# Altium schematic sheet PIC16F87.SchDoc
size A4
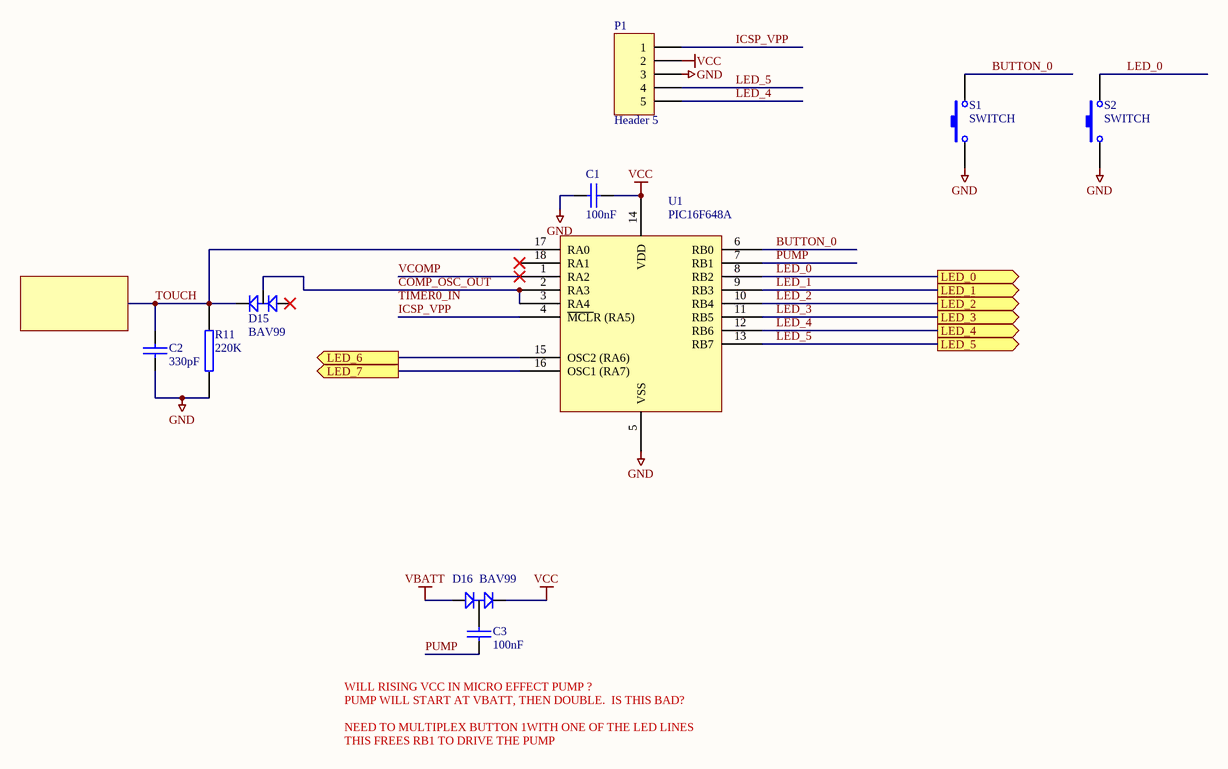
[diagram p0: PIC16F87.SchDoc]

## Parts
C1  100nF  [CAP (3D) - 0603]
C2  330pF  [CAP (3D) - 0603]
C3  100nF  [CAP (3D) - 0603]
D15  BAV99  [SOT23-3L]
D16  BAV99  [SOT23-3L]
P1  Header 5  [HDR1X5]
R11  220K  [RES (3D) - 0603]
S1  SWITCH  [TACT 6mm]
S2  SWITCH  [TACT 6mm]
U1  PIC16F648A  [SOIC-18]

## Ports
LED_0 (out), LED_1 (out), LED_2 (out), LED_3 (out), LED_4 (out), LED_5 (out), LED_6 (out), LED_7 (out)

## Nets
GND: C1.1 C2.2 P1.3 R11.1 S1.1 S2.1 U1.5(VSS)
VBATT: D16.1(A1)
VCC: C1.2 D16.2(C2) P1.2 U1.14(VDD)
BUTTON_0: S1.2 U1.6(RB0)
COMP_OSC_OUT: D15.3(C1/A2) U1.2(RA3) U1.3(RA4)
ICSP_VPP: P1.1 U1.4(~{MCL}R_(RA5))
LED_0: S2.2 U1.8(RB2) ; port LED_0
LED_1: U1.9(RB3) ; port LED_1
LED_2: U1.10(RB4) ; port LED_2
LED_3: U1.11(RB5) ; port LED_3
LED_4: P1.5 U1.12(RB6) ; port LED_4
LED_5: P1.4 U1.13(RB7) ; port LED_5
LED_6: U1.15(OSC2_(RA6)) ; port LED_6
LED_7: U1.16(OSC1_(RA7)) ; port LED_7
PUMP: C3.2 U1.7(RB1)
TOUCH: C2.1 D15.2(C2) R11.2 U1.17(RA0)
VCOMP: U1.1(RA2)
NetC3_1: C3.1 D16.3(C1/A2)

Not connected (* = marked no-connect by the designer): D15 1(A1)*; U1 18(RA1)*

## Notes on the sheet
- (near C3) WILL RISING VCC IN MICRO EFFECT PUMP ?
- PUMP WILL START AT VBATT, THEN DOUBLE.  IS THIS BAD?
- NEED TO MULTIPLEX BUTTON 1WITH ONE OF THE LED LINES
- THIS FREES RB1 TO DRIVE THE PUMP
- Labels drawn without touching a wire or pin: TIMER0_IN

## Library data of the parts
C1-C3 = CAP: CAPACITOR SMD 0402; Supplier 1: Mouser; Supplier Part Number 1: 810-CGJ3E2X7R1H104K
  C1 C3: value: 100nF
  C2: value: 330pF
D15 D16 = BAV99: DUAL DIODE, BAV99; Manufacturer: FAIRCHILD SEMICONDUCTOR; Mouser Part no.: 771-BAV99/T3; Farnell Part no.: 9843612; Manufacturer Part No.: BAV99; PackageReference: SOT-23; value: BAV99; Web link: http://au.mouser.com/ProductDetail/NXP-Semiconductors/BAV99-T3/?qs=sGAEpiMZZMtldOIVIVqa3WNg7zlWz8nBhXHsMX6ttIg%3d
P1 = Header 5: Header, 5-Pin; LatestRevisionDate: 17-Jul-2002; LatestRevisionNote: Re-released for DXP Platform.; Publisher: Altium Limited
R11 = RES: ZERO OHM LINK; value: 220K; Supplier 1: Mouser; Supplier Part Number 1: 652-CR0603JW-224ELF; Supplier 2: Digi-Key; Supplier Part Number 2: P220KHCT-ND
S1 S2 = TACT SWITCH ALPS SKQMAQ: Manufacturer: Mountain Switch; Manufacturer Part No.: 101-0264-EV; PackageReference: SPST-2; Mouser Part no.: 101-0264-EV; Web link: http://au.mouser.com/ProductDetail/Mountain-Switch/101-0264-EV/?qs=sGAEpiMZZMsgGjVA3toVBDnZjK1udZ%2fpYjk5pdxgsFo%3d; Value: SWITCH
U1 = PIC16F87/88: PIC16F88; Manufacturer: Microchip Technology; Manufacturer Part No.: PIC16F88-E/SS; Mouser Part no.: 579-PIC16F88-E/SS; Farnell Part no.: 9761519; value: PIC16F88; Web link: http://au.mouser.com/ProductDetail/Microchip-Technology/PIC16F88-E-SS/?qs=sGAEpiMZZMvu0Nwh4cA1waDrdroEY0RCb%252bRi%252b4Dz0K0%3d